# EAGLE design NHD-C12832A-Breakout (EAGLE 7.2.0)
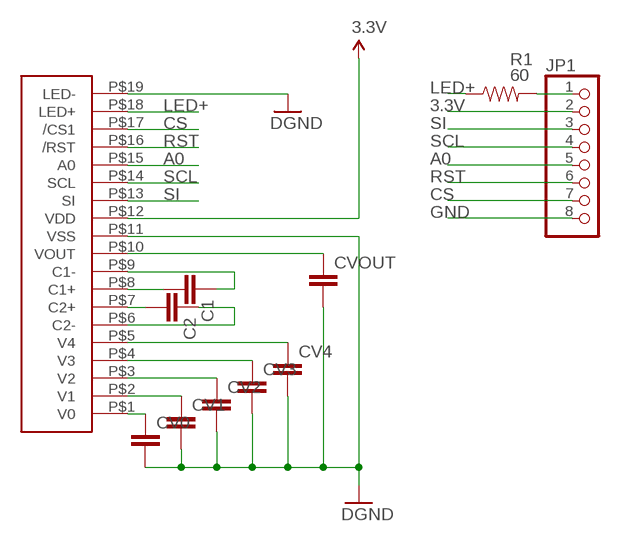
[diagram p0: schematic, sheet 1]

## Parts
C1  C-EUC0805  [C0805]
C2  C-EUC0805  [C0805]
CV0  C-EUC0805  [C0805]
CV1  C-EUC0805  [C0805]
CV2  C-EUC0805  [C0805]
CV3  C-EUC0805  [C0805]
CV4  C-EUC0805  [C0805]
CVOUT  C-EUC0805  [C0805]
JP1  PINHD-1X8  [1X08]
R1  60  RESISTOR0805-RES  [0805]
U$1  NHD-C12832A  [NHD-C12832A-PACK]

## Nets
3.3V: JP1.2 U$1.P$12(VDD)
A0: JP1.5 U$1.P$15(A0)
CS: JP1.7 U$1.P$17(/CS1)
GND: CV0.2 CV1.2 CV2.2 CV3.2 CV4.2 CVOUT.2 JP1.8 U$1.P$11(VSS) U$1.P$19(LED-) ; supply symbol labelled DGND
LED+: R1.1 U$1.P$18(LED+)
N$1: CV4.1 U$1.P$5(V4)
N$2: CV3.1 U$1.P$4(V3)
N$3: CV2.1 U$1.P$3(V2)
N$4: CV1.1 U$1.P$2(V1)
N$5: CV0.1 U$1.P$1(V0)
N$6: CVOUT.1 U$1.P$10(VOUT)
N$7: C1.1 U$1.P$9(C1-)
N$8: C1.2 U$1.P$8(C1+)
N$9: C2.2 U$1.P$7(C2+)
N$10: C2.1 U$1.P$6(C2-)
N$11: JP1.1 R1.2
RST: JP1.6 U$1.P$16(/RST)
SCL: JP1.4 U$1.P$14(SCL)
SI: JP1.3 U$1.P$13(SI)

## Library data of the parts
C1 C2 CV0 CV1-CV4 CVOUT = rcl:C-EU: CAPACITOR, European symbol
JP1 = pinhead:PINHD-1X8: PIN HEADER
R1 = SparkFun-Resistors:RESISTOR: Resistor Basic schematic elements and footprints for 0603, 1206, and PTH resistors.
U$1 = elegantcircuits:NHD-C12832A

## Board
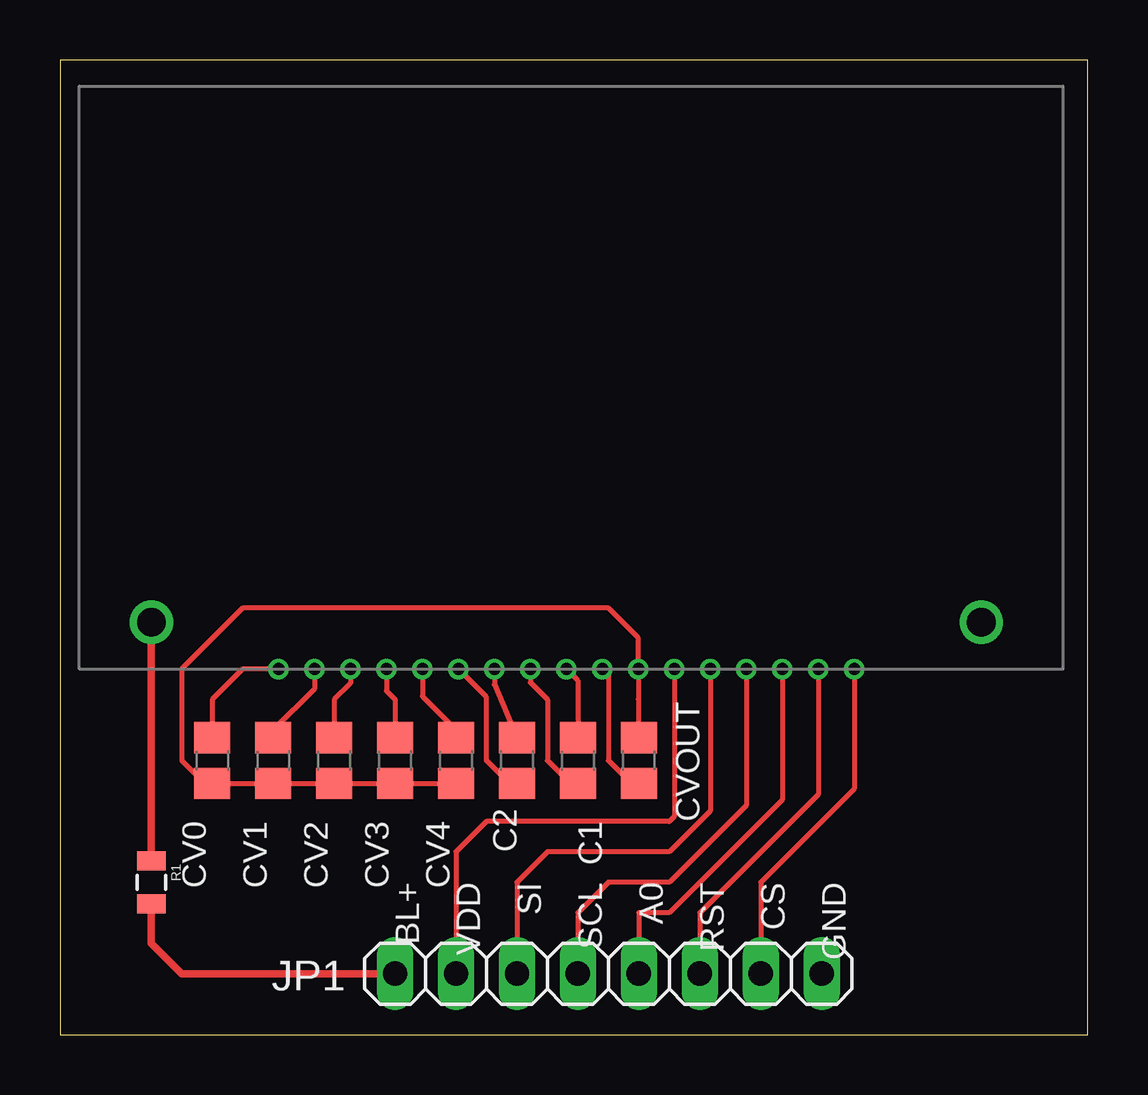
[diagram p1: board, top side]
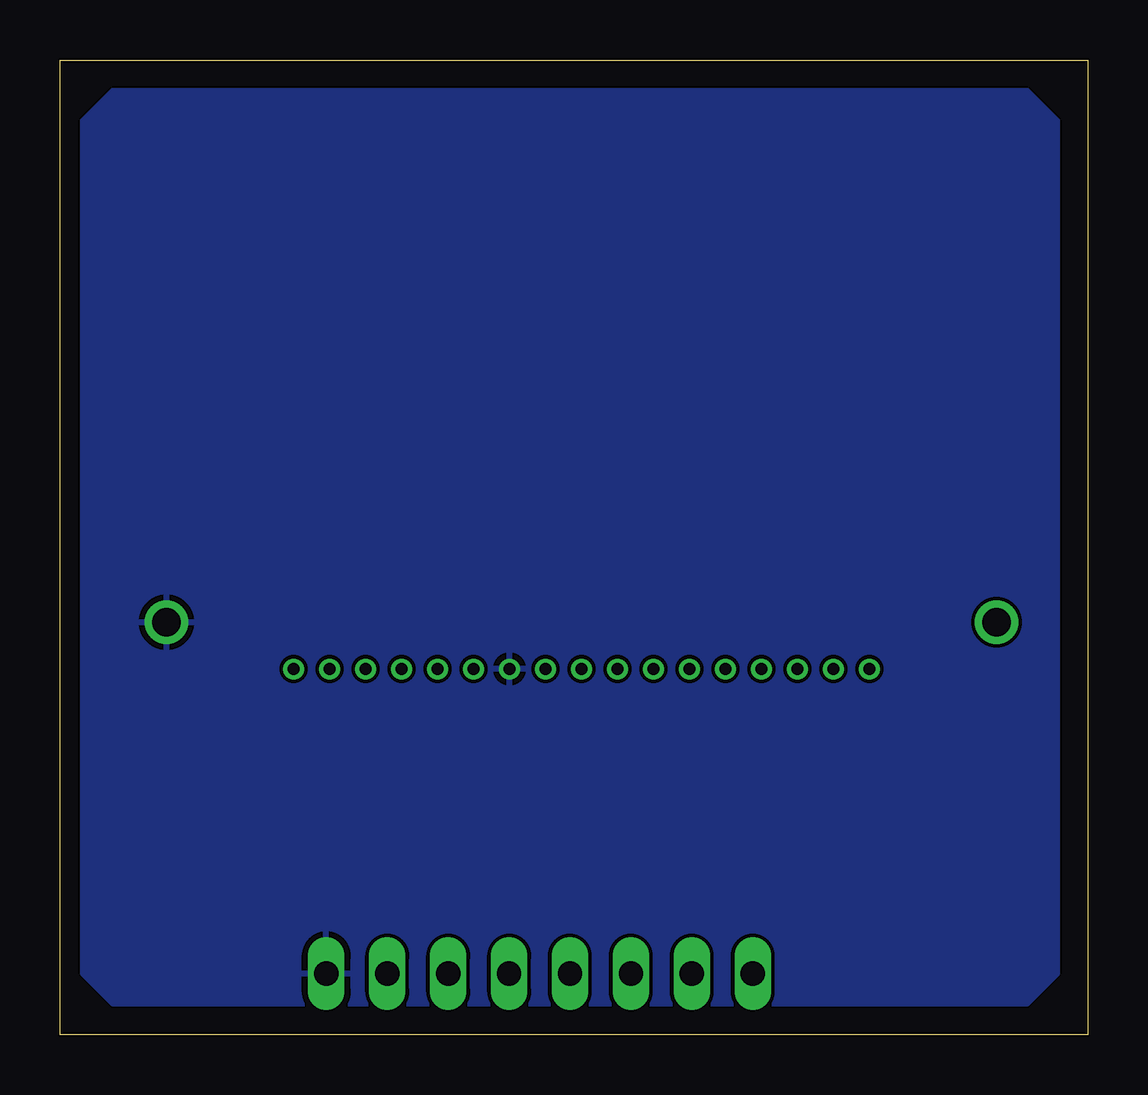
[diagram p2: board, bottom side, seen from below]

Size 42.85 x 40.63 mm. Coordinates in mm from the lower left corner, seen from the top.
Outline: 0,0 42.85,0 42.85,40.63 0,40.63 0,0
Copper layers (1*16): Top 0.0356mm / dielectric 1.5011mm / Bottom 0.0356mm
Design rules "LaenPCBOrder": minimum track width 6mil, minimum drill 13mil, track to track 6mil, track to pad 6mil, pad to pad 6mil, via to via 6mil, smd to smd 6mil, copper to edge 15mil, drill to drill 6mil, minimum pad ring 7mil, minimum via ring 7mil, stop-mask expansion 3mil, vias tented up to drill 0mil, thermal gap 10mil

### Footprints (pad centres in the part's own frame; a part is rotated, then mirrored left to right if it is on the bottom)
C0805 = smd 1.3 x 1.5: 1 -0.95,0; 2 0.95,0
1X08 = drill 1.016 long: 1 -8.89,0; 2 -6.35,0; 3 -3.81,0; 4 -1.27,0; 5 1.27,0; 6 3.81,0; 7 6.35,0; 8 8.89,0
0805 = smd 0.8 x 1.2: 1 -0.9,0; 2 0.9,0
NHD-C12832A-PACK = drill 0.5: P$1 5.3,0; P$2 6.8,0; P$3 8.3,0; P$4 9.8,0; P$5 11.3,0; P$6 12.8,0; P$7 14.3,0; P$8 15.8,0; P$9 17.3,0; P$10 18.8,0; P$11 20.3,0; P$12 21.8,0; P$13 23.3,0; P$14 24.8,0; P$15 26.3,0; P$16 27.8,0; P$17 29.3,0 | drill 1.2: P$18 0,1.95; P$19 34.6,1.95

### Placement (x,y rotation side)
C1  21.59,11.43 270 top
C2  19.05,11.43 90 top
CV0  6.35,11.43 270 top
CV1  8.89,11.43 270 top
CV2  11.43,11.43 270 top
CV3  13.97,11.43 270 top
CV4  16.51,11.43 270 top
CVOUT  24.13,11.43 90 top
JP1  22.86,2.54 0 top
R1  3.81,6.35 270 top
U$1  3.81,15.24 0 top

### Tracks (layer width: path | path; a pad name or v marks a point on that pad's centre or on a via)
3.3V
  Top 0.203: U$1.P$12 25.61,9.1 25.4,8.89 17.78,8.89 16.51,7.62 JP1.2
A0
  Top 0.203: U$1.P$15 30.11,9.79 25.4,5.08 24.13,5.08 JP1.5
CS
  Top 0.203: U$1.P$17 33.11,10.25 29.21,6.35 JP1.7
GND
  Top 0.203: CV4.2 CV3.2 CV2.2 CV1.2 CV0.2 6.35,10.16 5.08,11.43 5.08,15.24 7.62,17.78 22.86,17.78 24.11,16.53 U$1.P$11 24.11,13.99 | 24.11,13.99 24.13,13.97 | 24.11,13.99 24.11,12.4 CVOUT.2
  pour Bottom: 2.54,39.37 1.27,38.1 1.27,2.54 2.54,1.27 40.64,1.27 41.91,2.54 41.91,38.1 40.64,39.37
LED+
  Top 0.305: R1.1 U$1.P$18
N$1
  Top 0.203: U$1.P$5 15.11,14.1 16.51,12.7 CV4.1
N$2
  Top 0.203: U$1.P$4 13.61,14.33 13.97,13.97 CV3.1
N$3
  Top 0.203: U$1.P$3 12.11,14.65 11.43,13.97 CV2.1
N$4
  Top 0.203: U$1.P$2 10.61,14.42 8.89,12.7 CV1.1
N$5
  Top 0.203: U$1.P$1 7.62,15.24 6.35,13.97 CV0.1
N$6
  Top 0.203: U$1.P$10 22.86,14.99 22.86,11.43 24.13,10.16 CVOUT.1
N$7
  Top 0.203: U$1.P$9 21.59,14.76 C1.1
N$8
  Top 0.203: U$1.P$8 19.61,14.68 20.32,13.97 20.32,11.43 21.59,10.16 C1.2
N$9
  Top 0.203: U$1.P$7 18.11,14.59 C2.2
N$10
  Top 0.203: C2.1 18.73,10.48 17.78,11.43 17.78,14.07 U$1.P$6
N$11
  Top 0.305: R1.2 3.81,3.81 5.08,2.54 JP1.1
RST
  Top 0.203: U$1.P$16 31.61,10.02 26.67,5.08 JP1.6
SCL
  Top 0.203: U$1.P$14 28.61,9.56 25.4,6.35 22.86,6.35 21.59,5.08 JP1.4
SI
  Top 0.203: U$1.P$13 27.11,9.33 25.4,7.62 20.32,7.62 19.05,6.35 JP1.3

### Text on the board
tNames: BL+ | VDD | SI | SCL | A0 | RST | CS | GND